# Altium schematic sheet Display_Mux.SchDoc
size A
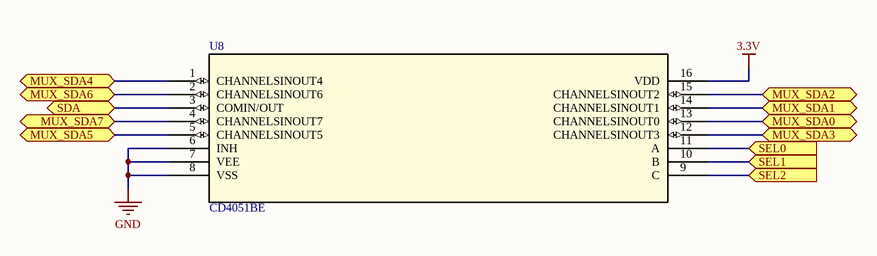
[diagram p0: Display_Mux.SchDoc]

## Parts
U8  CD4051BE  [N16]

## Ports
MUX_SDA0 (bidir), MUX_SDA1 (bidir), MUX_SDA2 (bidir), MUX_SDA3 (bidir), MUX_SDA4 (bidir), MUX_SDA5 (bidir), MUX_SDA6 (bidir), MUX_SDA7 (bidir), SDA (bidir), SEL0 (in), SEL1 (in), SEL2 (in)

## Nets
3.3V: U8.16(VDD)
GND: U8.6(INH) U8.7(VEE) U8.8(VSS)
MUX_SDA0: U8.13(CHANNELSINOUT0) ; port MUX_SDA0
MUX_SDA1: U8.14(CHANNELSINOUT1) ; port MUX_SDA1
MUX_SDA2: U8.15(CHANNELSINOUT2) ; port MUX_SDA2
MUX_SDA3: U8.12(CHANNELSINOUT3) ; port MUX_SDA3
MUX_SDA4: U8.1(CHANNELSINOUT4) ; port MUX_SDA4
MUX_SDA5: U8.5(CHANNELSINOUT5) ; port MUX_SDA5
MUX_SDA6: U8.2(CHANNELSINOUT6) ; port MUX_SDA6
MUX_SDA7: U8.4(CHANNELSINOUT7) ; port MUX_SDA7
SDA: U8.3(COMIN/OUT) ; port SDA
SEL0: U8.11(A) ; port SEL0
SEL1: U8.10(B) ; port SEL1
SEL2: U8.9(C) ; port SEL2

## Library data of the parts
U8 = CD4051BE: Imported; Vendor: Texas Instruments; Section: Switches and Multiplexers; C: Copyright (C) 2015 Accelerated Designs. All rights reserved; Manufacturer_Part_Number: CD4051BE; Family: Analogue Switch Multiplexer; Manufacturer_Name: Texas Instruments; Copyright: Copyright (C) 2015 Accelerated Designs. All rights reserved; RS_Part_Number: 5036098; Value: Value; Type: Type; RefDes: RefDes